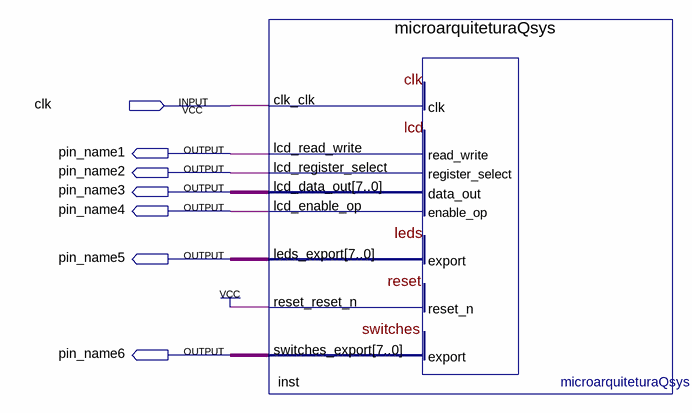
[diagram p0: schematic sheet]
// Quartus schematic microarquitetura1.bdf as structural Verilog: 1 symbols, 7 pins
module microarquitetura1 (
  input  clk,
  output pin_name1,
  output pin_name2,
  output pin_name3,
  output pin_name4,
  output pin_name5,
  output pin_name6
);

  wire [7:0] inst_lcd_data_out, inst_leds_export, undriven;

  microarquiteturaQsys inst (
    .clk_clk(clk), .reset_reset_n(1'b1), .switches_export(undriven), .lcd_read_write(pin_name1),
    .lcd_register_select(pin_name2), .lcd_data_out(inst_lcd_data_out), .lcd_enable_op(pin_name4),
    .leds_export(inst_leds_export));
endmodule
